# EAGLE design easyMySens-v006 (EAGLE 7.3.0)
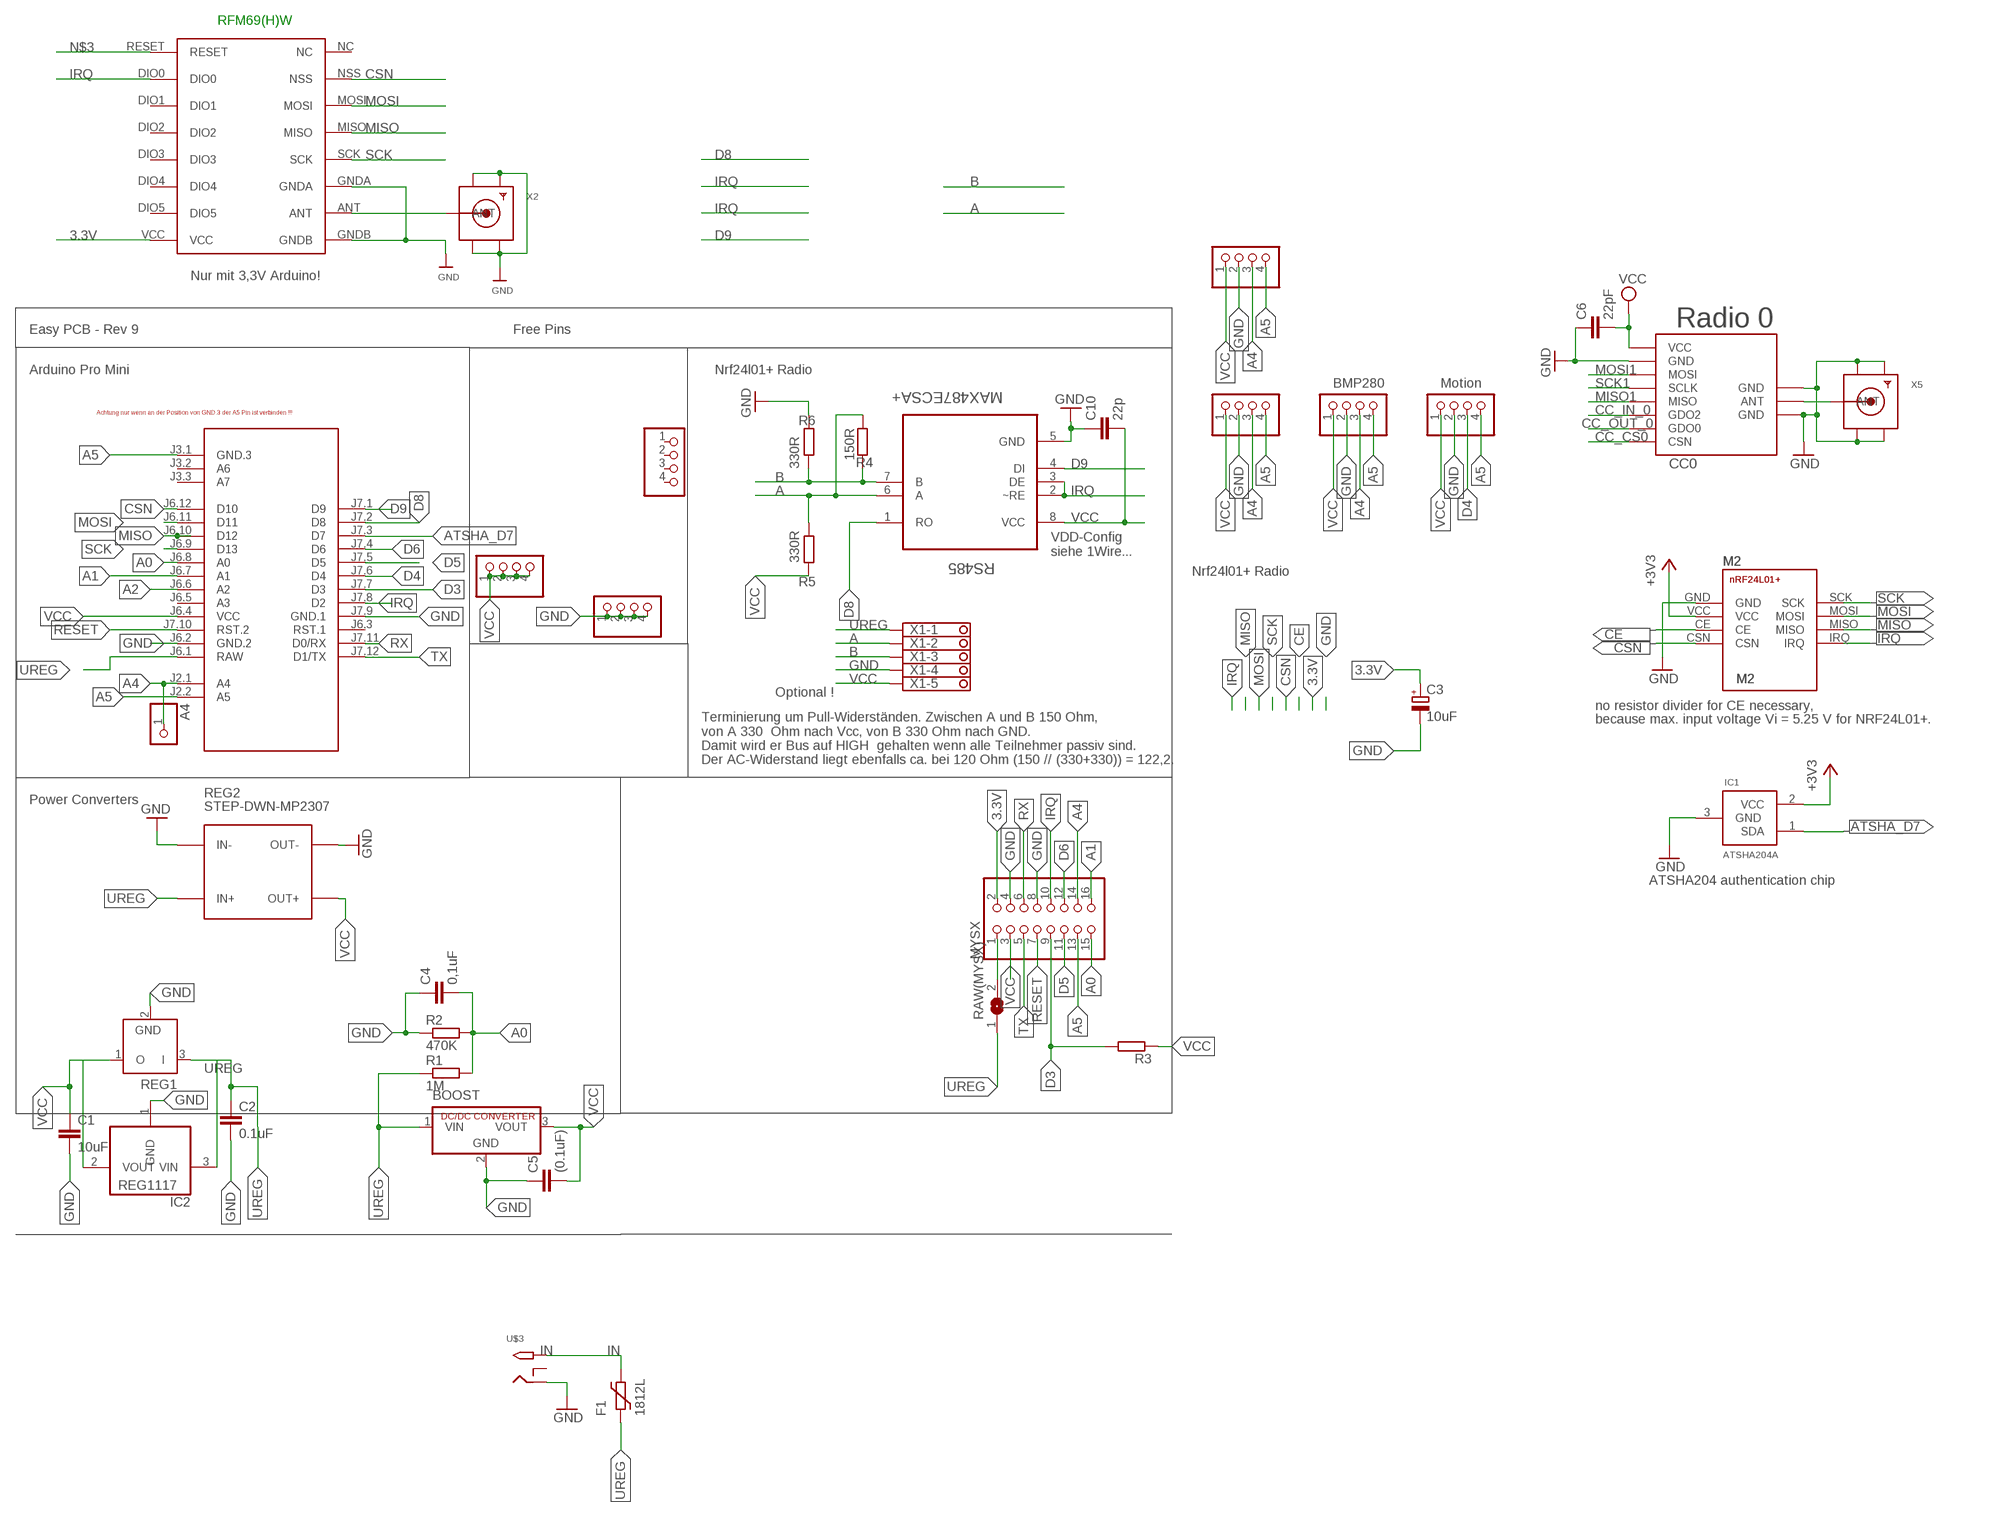
[diagram p0: schematic, sheet 1]

## Parts
A4  PINHD-1X1  [1X01]
BH1750  PINHD-1X04_2.54-S  [1X04-S]
BOOST  R-78C1.8-1.0  [SIP3]
C1  10uF  C-EUC1210  [C1210]
C2  0.1uF  C-EUC1206  [C1206]
C3  10uF  CPOL-EUSMCC  [SMC_C]
C4  0,1uF  C-EUC1206  [C1206]
C5  (0.1uF)  C-EUC1206  [C1206]
C6  22pF  C-EUC0805  [C0805]
C10  22p  C-EUC0805  [C0805]
CC0  CC1101  CC1101_MODULE1SMD  [CC1101_MODULE1_SMD]
F1  1812L  [1812L]
I2C-1  PINHD-1X04_2.54-S  [1X04-S]
I2C-2  PINHD-1X04_2.54-S  [1X04-S]
IC1  ATSHA204A  [SOT23]
IC2  REG1117  [SOT223]
JP1  PINHD-1X04_2.54-S  [1X04-S]
JP3  PINHD-1X04_2.54-S  [1X04-S]
JP12  PINHD-1X04_2.54-S  [1X04-S]
M1  ARDUINO-PRO-MINI-3.3V#NP  [ARDUINO-PRO-MINI#NP]
M2  NRF24L01+SMD  [NRF24L01+SMD]
MOTION  PINHD-1X04_2.54-S  [1X04-S]
MYSX  PINHD-2X08_2.54  [2X08]
R1  1M  R-EU_R0805  [R0805]
R2  470K  R-EU_R0805  [R0805]
R3  R-EU_R0805  [R0805]
R4  150R  R-EU_R0805  [R0805]
R5  330R  R-EU_R0805  [R0805]
R6  330R  R-EU_R0805  [R0805]
RAW(MYSX)  SJ  [SJ]
REG1  LP2950Z  [TO92]
REG2  STEP-DWN-MP2307  DC-DC-STEP-DOWN-MP2307  [DC-DC-STEP-DOWN-MP2307]
RFM69W  RFM69HW  [RFM]
RS485  MAX487ECSA+  [SOIC127P600X175-8N]
U$3  2.1MMJACKTHM  [PJ-102A]
X1  1751277  [1751277]
X2  SMACONNECTOR_EDGE  [SMA_EDGELAUNCH]
X5  SMACONNECTOR_EDGE  [SMA_EDGELAUNCH]

## Nets
3.3V [Power]: C3.+ IC1.2(VCC) M2.VCC MYSX.2 RFM69W.VCC ; supply symbol labelled +3V3
A: R4.1 R5.2 RS485.6(A) X1.2
A0: C4.2 M1.J6.8(A0) MYSX.15 R1.2 R2.2
A1: M1.J6.7(A1) MYSX.16
A2: M1.J6.6(A2)
A4: A4.1 BH1750.3 I2C-1.3 I2C-2.3 M1.J2.1(A4) MYSX.14
A5: BH1750.4 I2C-1.4 I2C-2.4 M1.J2.2(A5) M1.J3.1(GND.3) MOTION.4 MYSX.13
ANT0: CC0.ANT X5.P(ANT)
ATSHA_D7: IC1.1(SDA) M1.J7.3(D7)
B: R4.2 R6.1 RS485.7(B) X1.3
CC_CS0: CC0.CSN
CC_IN_0: CC0.GDO2
CC_OUT_0: CC0.GDO0
CE: M2.CE
CSN: M1.J6.12(D10) M2.CSN RFM69W.NSS
D3: M1.J7.7(D3) MYSX.9 R3.2
D4: M1.J7.6(D4) MOTION.3
D5: M1.J7.5(D5) MYSX.11
D6: M1.J7.4(D6) MYSX.12
D8: M1.J7.2(D8) RS485.1(RO)
D9: M1.J7.1(D9) RS485.4(DI)
GND [Power]: BH1750.2 BOOST.2(GND) C1.2 C2.2 C3.- C4.1 C5.1 C6.1 C10.1 CC0.GND@0(GND) CC0.GND@1(GND) CC0.GND@2(GND) I2C-1.2 I2C-2.2 IC1.3(GND) IC2.1(GND) JP1.1 JP1.2 JP1.3 JP1.4 M1.J6.2(GND.2) M1.J7.9(GND.1) M2.GND MOTION.2 MYSX.4 MYSX.8 R2.1 R6.2 REG1.2(GND) REG2.IN- REG2.OUT- RFM69W.GNDA RFM69W.GNDB RS485.5(GND) U$3.RING X1.4 X2.GND@1(GND4) X2.GND@2(GND3) X2.GND@3(GND2) X2.GND@4(GND1) X5.GND@1(GND4) X5.GND@2(GND3) X5.GND@3(GND2) X5.GND@4(GND1)
IN [Power]: F1.P$2 U$3.TIP
IRQ: M1.J7.8(D2) M2.IRQ MYSX.10 RFM69W.DIO0 RS485.2(~RE) RS485.3(DE)
MISO: M1.J6.10(D12) M2.MISO RFM69W.MISO
MISO1: CC0.MISO
MOSI: M1.J6.11(D11) M2.MOSI RFM69W.MOSI
MOSI1: CC0.MOSI
N$1: MYSX.1 RAW(MYSX).2
N$3: RFM69W.RESET
N$16: RFM69W.ANT X2.P(ANT)
RESET: M1.J7.10(RST.2) MYSX.7
RX: M1.J7.11(D0/RX) MYSX.6
SCK: M1.J6.9(D13) M2.SCK RFM69W.SCK
SCK1: CC0.SCLK
TX: M1.J7.12(D1/TX) MYSX.5
UREG [Power]: BOOST.1(VIN) C2.1 F1.P$1 IC2.3(VIN) M1.J6.1(RAW) R1.1 RAW(MYSX).1 REG1.3(I) REG2.IN+ X1.1
VCC [Power]: BH1750.1 BOOST.3(VOUT) C1.1 C5.2 C6.2 C10.2 CC0.VCC I2C-1.1 I2C-2.1 IC2.2(VOUT) JP3.1 JP3.2 JP3.3 JP3.4 M1.J6.4(VCC) MOTION.1 MYSX.3 R3.1 R5.1 REG1.1(O) REG2.OUT+ RS485.8(VCC) X1.5
Unconnected: JP12.1 JP12.2 JP12.3 JP12.4 M1.J3.2(A6) M1.J3.3(A7) M1.J6.3(RST.1) M1.J6.5(A3) RFM69W.DIO1 RFM69W.DIO2 RFM69W.DIO3 RFM69W.DIO4 RFM69W.DIO5 RFM69W.NC U$3.RING_SW

## Notes on the sheet
- RFM69(H)W
- Nur mit 3,3V Arduino!
- Radio 0
- Easy PCB - Rev 9 | Free Pins
- Arduino Pro Mini | Nrf24l01+ Radio
- BMP280 | Motion
- Achtung nur wenn an der Position von GND.3 der A5 Pin ist verbinden !!!
- VDD-Config
  siehe 1Wire...
- Nrf24l01+ Radio
- Optional !
- no resistor divider for CE necessary,
- because max. input voltage Vi = 5.25 V for NRF24L01+.
- Terminierung um Pull-Widerständen. Zwischen A und B 150 Ohm,
  von A 330  Ohm nach Vcc, von B 330 Ohm nach GND. 
  Damit wird er Bus auf HIGH  gehalten wenn alle Teilnehmer passiv sind.
  Der AC-Widerstand liegt ebenfalls ca. bei 120 Ohm (150 // (330+330)) = 122,2.
- Power Converters
- ATSHA204 authentication chip

## Library data of the parts
A4 = pinhead:PINHD-1X1: PIN HEADER
BH1750 I2C-1 I2C-2 JP1 JP3 JP12 MOTION = pinhead-2:PINHD-1X04: PIN HEADER
BOOST = dc-dc-converter:R-78C*-1.0: INNOLINE DC/DC-Converter 1.0 AMP SIP3 Single Output Source: Data sheet <http://www.mikrocontroller.net/attachment/150645/157764-da-01-en-DC_DC_WANDLER_R_78C5_0_1_0.pdf>
C1 C2 C4-C6 C10 = rcl:C-EU: CAPACITOR, European symbol
C3 = rcl:CPOL-EU: POLARIZED CAPACITOR, European symbol
CC0 = wireless:CC1101_MODULE1: CC1101 wireless module for 433/868 MHz (sold from Aliexpress). DIL version for mounting with pin header (and SMD soldering) and SMD only variant available.
F1 = ptc-littlefuse:1812L
IC1 = Sensor:ATSHA204A
IC2 = burr-brown:REG1117: 800mA and 1A Low Dropout (LDO) Positive Regulator 1.8V, 2.5V, 2.85V, 3.3V, 5V, and Adj; MPN: REG1117; OC_FARNELL: 1097566; OC_NEWARK: 14P6981
M1 = diy-modules:ARDUINO-PRO-MINI-*#NP: Arduino Pro Mini without programming pads
M2 = wireless:NRF24L01+: nRF24L01+ Transceiver Module
MYSX = pinhead-2:PINHD-2X08: PIN HEADER
R1-R6 = rcl:R-EU_: RESISTOR, European symbol
RAW(MYSX) = jumper:SJ: SMD solder JUMPER
REG1 = linear:LP2950: 100 mA, Low Power Low Dropout Voltage Regulator Source: http://www.onsemi.com/pub/Collateral/LP2950-D.PDF
REG2 = diy-modules:DC-DC-STEP-DOWN-MP2307: DC/DC Step-Down Regulator based on MP2307DN chip MP2307 datasheet available here: https://cdn-shop.adafruit.com/datasheets/MP2307_r1.9.pdf Click here to find device on ebay.com <http://www.ebay.com/sch/dc+dc+3a+mini+converter>
RFM69W = hoperf:RFM69HW
RS485 = Maxim_By_element14_Batch_1:MAX487ECSA+: Low-Power, Slew-Rate-Limited RS-485/RS-422 Transceivers; MPN: MAX487ECSA+; OC_FARNELL: 9724532; OC_NEWARK: 68K4803; PACKAGE: SOIC-8; SUPPLIER: Maxim
U$3 = adafruit:2.1MMJACK: 2.1mm x 5.5mm THM DC jack with internal switch. Digikey part #PJ-102A, 4UCON part #05537 2.1mm x 5.5mm SMT DC jack with internal switch. Digikey part #PJ-002A-SMT, 4UCON part #03267 By microbuilder.eu & adafruit.com
X1 = con-phoenix-350:1751277: MKDS 1/ 5-3,5 Printklemme Nennstrom: 10 A Bemessungsspannung: 160 V Raster: 3,5 mm Polzahl: 5 Montageart: Löten Anschlussart: Schraubanschluss Anschlussrichtung vom Leiter zur Platine: 0° Source: http://eshop.phoenixcontact.com .. 1751277.pdf; OC_FARNELL: unknown; OC_NEWARK: unknown
X2 X5 = adafruit:SMACONNECTOR: SMA Connector 90° DIP SMA Connector, 50 Ohm (4UConnector: 07259)

## Net classes
0 default: width 0.305 mm
1 Power: width 0.508 mm

## Board
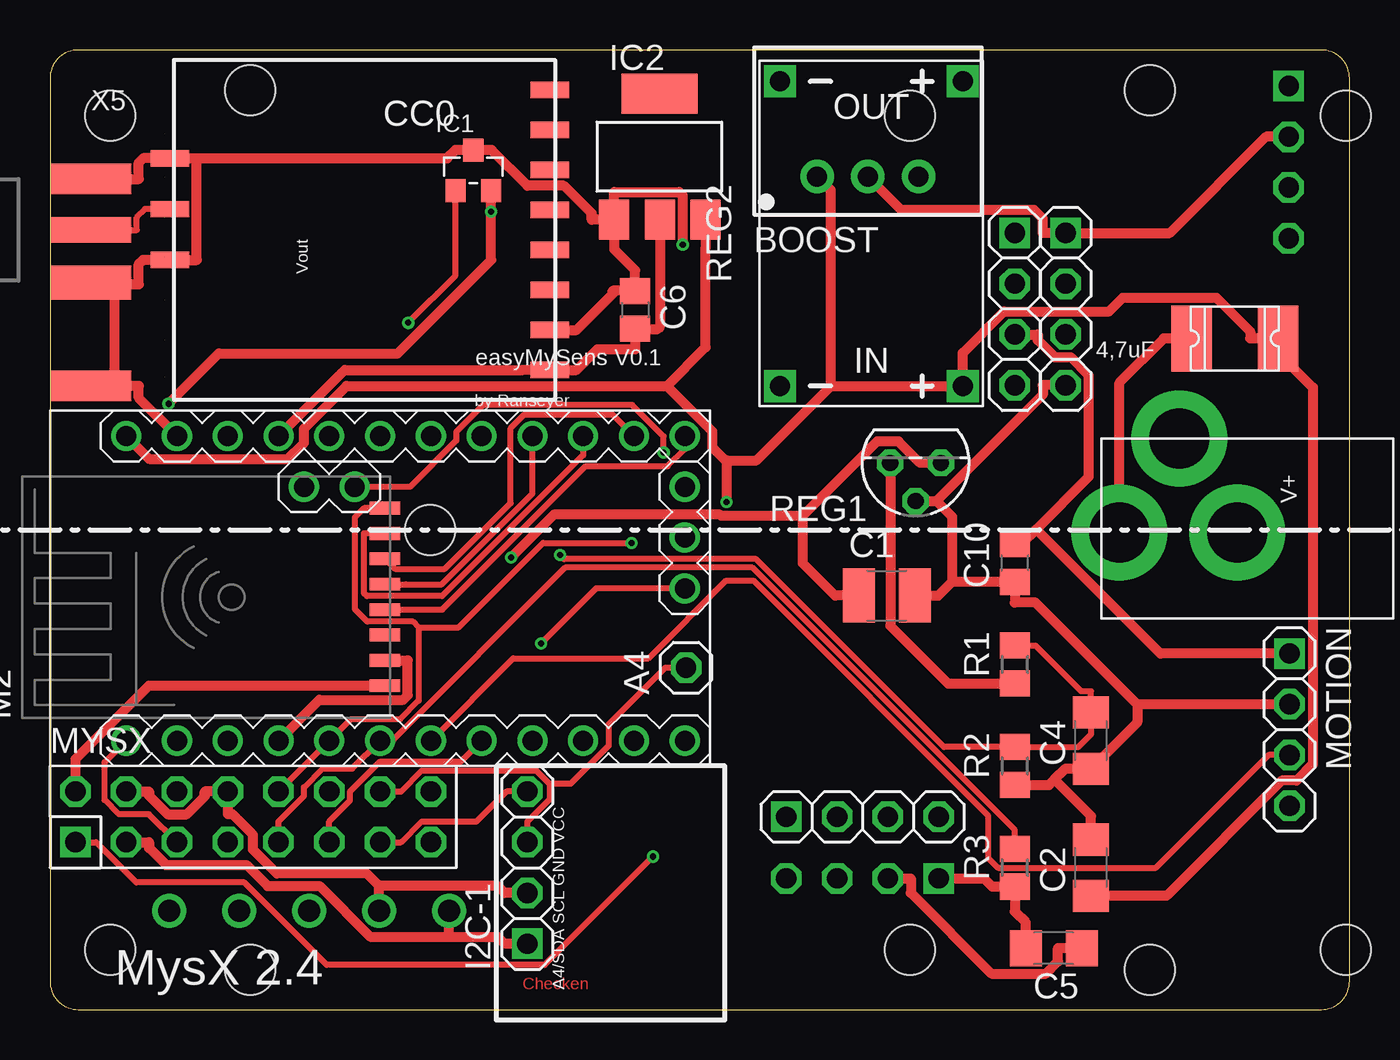
[diagram p1: board, top side]
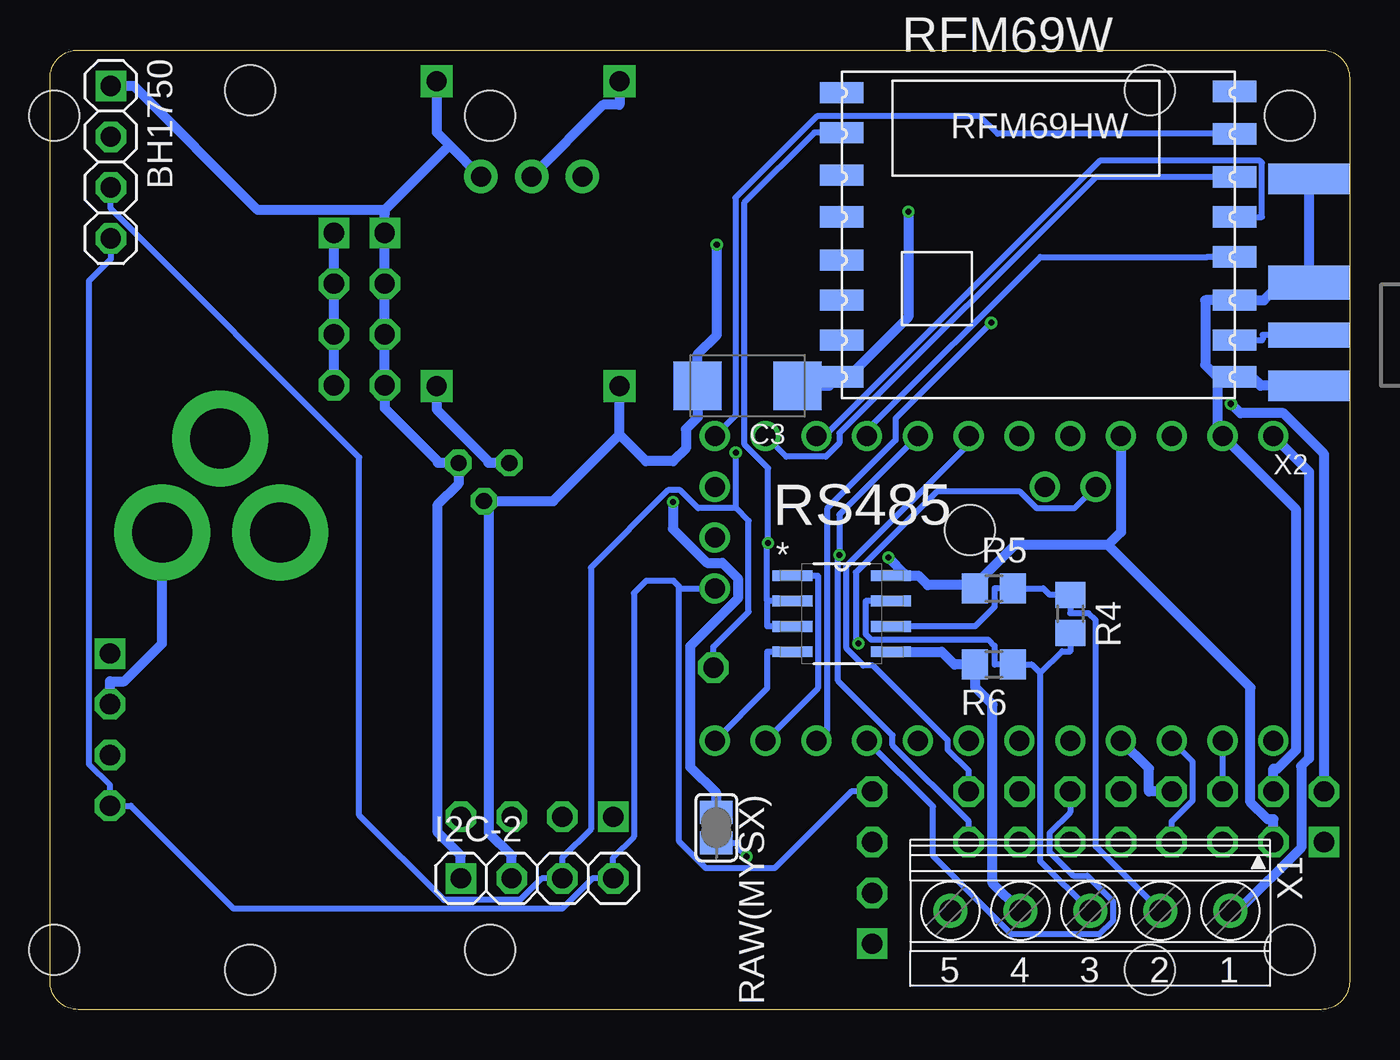
[diagram p2: board, bottom side, seen from below]

Size 65 x 48 mm. Coordinates in mm from the lower left corner, seen from the top.
Outline: 0,46.59 0,1.41 arc90 1.41,0 63.59,0 arc90 65,1.41 65,46.59 arc90 63.59,48 1.41,48 arc90 0,46.59
Copper layers (1*16): Top 0.035mm / dielectric 1.5mm / Bottom 0.035mm
Design rules "dirt_cheap_dirty_boards.v1": minimum track width 5mil, minimum drill 12mil, track to track 5mil, track to pad 5mil, pad to pad 5mil, via to via 5mil, smd to smd 0mil, copper to edge 10mil, drill to drill 10mil, minimum pad ring 10mil, minimum via ring 6mil, stop-mask expansion 2mil, vias tented up to drill 25mil, thermal gap 10mil
Holes 2.5 mm at 19,24 3,3 3,44.7 64.8,44.7 43,3 64.8,3 43,44.7 10,2 55,2 10,46 55,46
tRestrict: 20 lines
bRestrict: 19 lines

### Footprints (pad centres in the part's own frame; a part is rotated, then mirrored left to right if it is on the bottom)
1X01 = drill 1.016 octagon: 1 0,0
1X04-S = drill 1.016 square: 1 -3.81,0 | drill 1.016 octagon: 2 -1.27,0; 3 1.27,0; 4 3.81,0
SIP3 = drill 1 pad 1.676: 1 -2.54,0; 2 0,0; 3 2.54,0
C1210 = smd 1.6 x 2.7: 1 -1.4,0; 2 1.4,0
C1206 = smd 1.6 x 1.8: 1 -1.4,0; 2 1.4,0
SMC_C = smd 2.4 x 2.4: + -2.5,0; - 2.5,0
C0805 = smd 1.3 x 1.5: 1 -0.95,0; 2 0.95,0
CC1101_MODULE1_SMD = smd 1.93 x 0.813: ANT 19,5.96; CSN 0,0; GDO0 0,2; GDO2 0,4; GND@0 0,12; GND@1 19,8.5; GND@2 19,3.42; MISO 0,6; MOSI 0,10; SCLK 0,8; VCC 0,14
1812L = smd 2.03 x 3.3: P$1 -2.16,0; P$2 2.16,0
SOT23 = smd 1.016 x 1.143: 1 -0.889,-1.016; 2 0.889,-1.016; 3 0,1.016
SOT223 = smd 1.499 x 2.007: 1 -2.261,-3.15; 2 0.025,-3.15; 3 2.311,-3.15 | smd 3.81 x 2.007: 4 0,3.15
ARDUINO-PRO-MINI#NP = drill 1: J2.1 -1.27,5.08; J2.2 -3.81,5.08; J3.1 15.24,0; J3.2 15.24,2.54; J3.3 15.24,5.08; J6.1 -12.7,7.62; J6.2 -10.16,7.62; J6.3 -7.62,7.62; J6.4 -5.08,7.62; J6.5 -2.54,7.62; J6.6 0,7.62; J6.7 2.54,7.62; J6.8 5.08,7.62; J6.9 7.62,7.62; J6.10 10.16,7.62; J6.11 12.7,7.62; J6.12 15.24,7.62; J7.1 15.24,-7.62; J7.2 12.7,-7.62; J7.3 10.16,-7.62; J7.4 7.62,-7.62; J7.5 5.08,-7.62; J7.6 2.54,-7.62; J7.7 0,-7.62; J7.8 -2.54,-7.62; J7.9 -5.08,-7.62; J7.10 -7.62,-7.62; J7.11 -10.16,-7.62; J7.12 -12.7,-7.62
NRF24L01+SMD = smd 0.635 x 1.524: CE -1.575,-7.861; CSN -0.305,-7.861; GND -2.845,-7.861; IRQ 4.775,-7.861; MISO 3.505,-7.861; MOSI 2.235,-7.861; SCK 0.965,-7.861; VCC -4.115,-7.861
2X08 = drill 1.016 square: 1 -8.89,-1.27 | drill 1.016 octagon: 2 -8.89,1.27; 3 -6.35,-1.27; 4 -6.35,1.27; 5 -3.81,-1.27; 6 -3.81,1.27; 7 -1.27,-1.27; 8 -1.27,1.27; 9 1.27,-1.27; 10 1.27,1.27; 11 3.81,-1.27; 12 3.81,1.27; 13 6.35,-1.27; 14 6.35,1.27; 15 8.89,-1.27; 16 8.89,1.27
R0805 = smd 1.3 x 1.5: 1 -0.95,0; 2 0.95,0
SJ = smd 1.168 x 1.6: 1 -0.762,0; 2 0.762,0
TO92 = drill 0.813 octagon: 1 -1.27,0; 2 0,1.905; 3 1.27,0
DC-DC-STEP-DOWN-MP2307 = drill 1 pad 1.6 square: IN+ -7.62,-4.572; IN- -7.62,4.572; OUT+ 7.62,-4.572; OUT- 7.62,4.572
RFM = smd 2.184 x 1.067: ANT 19.651,2.889; DIO0 0,13.27; DIO1 0,11.143; DIO2 0,9.047; DIO3 0,6.889; DIO4 0,4.889; DIO5 0,2.889; GNDA 19.651,4.889; GNDB 19.651,1.048; MISO 19.651,9.047; MOSI 19.651,11.047; NC 19.651,15.334; NSS 19.651,13.206; RESET 0,15.27; SCK 19.651,7.048; VCC 0,1.048
SOIC127P600X175-8N = smd 1.981 x 0.533: 1 -2.464,1.905; 2 -2.464,0.635; 3 -2.464,-0.635; 4 -2.464,-1.905; 5 2.464,-1.905; 6 2.464,-0.635; 7 2.464,0.635; 8 2.464,1.905
PJ-102A = drill 3 pad 4.8: RING 0.1,-3.39; RING_SW -4.6,-6.29; TIP 0.1,-9.29
1751277 = drill 1.1 pad 1.7: 1 -7,-0.1; 2 -3.5,-0.1; 3 0,-0.1; 4 3.5,-0.1; 5 7,-0.1
SMA_EDGELAUNCH = smd 4.064 x 1.524: GND@1 2.032,-2.54; GND@2 2.032,2.54 | smd 4.064 x 1.524 bottom: GND@3 2.032,2.54; GND@4 2.032,-2.54 | smd 4.064 x 1.27: P 2.032,0

### Placement (x,y rotation side)
A4  31.82,17.1 90 top
BH1750  61.96,42.39 270 bottom
BOOST  40.91,41.67 0 top
C1  41.85,20.7 0 top
C2  52.07,7.1 90 top
C3  30.11,31.2 180 bottom
C4  52.07,13.45 90 top
C5  50.2,3.07 180 top
C6  29.27,35 270 top
C10  48.26,22.34 90 top
CC0  25,46 180 top
F1  59.27,33.57 180 top
I2C-1  23.88,7.1 90 top
I2C-2  40.64,6.56 0 bottom
IC1  21.18,41.97 0 top
IC2  30.48,42.66 0 top
JP1  50.8,35.04 270 top
JP3  48.26,35.04 270 top
JP12  40.64,9.64 0 top
M1  16.51,21.07 0 top
M2  8.89,20.31 90 top
MOTION  62,14 270 top
MYSX  10.16,9.64 0 top
R1  48.26,17.26 90 top
R2  48.26,12.18 90 top
R3  48.26,7.1 90 top
R4  13.97,19.8 270 bottom
R5  17.78,21.07 0 bottom
R6  17.78,17.26 180 bottom
RAW(MYSX)  31.68,9.1 270 bottom
REG1  43.3,27.34 180 top
REG2  41.09,38.81 90 top
RFM69W  25.4,30.59 0 bottom
RS485  25.4,19.8 0 bottom
U$3  62.78,23.96 270 top
X1  12.97,4.83 180 bottom
X2  0,33.74 180 bottom
X5  0,39 0 top

### Tracks (layer width: path | path; a pad name or v marks a point on that pad's centre or on a via)
3.3V  (via drill 0.3 pad 0.61)
  Top 0.508: v5.93,30.3 8.45,32.82 17.39,32.82 22.06,37.5 v22.06,39.91 IC1.2 | MYSX.2 1.27,12.52 4.95,16.19 15.61,16.19 M2.VCC
  Bottom 0.508: C3.+ 26.03,31.2 25.58,31.64 RFM69W.VCC 25.07,31.64 22.06,34.64 v22.06,39.91 | MYSX.2 1.27,27.78 3.31,29.83 5.45,29.83 v5.93,30.3
A
  Bottom 0.305: RS485.6 18.73,19.16 17.76,20.14 17.76,21.07 R5.2 15.32,21.07 15,20.75 R4.1 13.97,19.82 13.04,19.82 12.7,19.48 12.7,8.16 X1.2
A0  (via drill 0.3 pad 0.61)
  Top 0.305: v25.52,22.74 25.72,22.54 35.31,22.54 44.72,13.13 R2.2 51.43,13.13 52.07,13.77 C4.2 52.07,15.93 51.57,15.93 49.29,18.21 R1.2
  Bottom 0.305: M1.J6.8 25.52,24.76 v25.52,22.74 25.59,22.67 25.59,16.44 22.86,13.72 22.86,13.22 19.05,9.41 MYSX.15
A1
  Bottom 0.305: MYSX.16 19.05,11.95 20.09,12.99 20.09,13.47 23.83,17.21 24.32,17.21 25.15,18.05 25.15,22.18 19.05,28.28 M1.J6.7
A4  (via drill 0.3 pad 0.61)
  Top 0.305: A4.1 30.77,17.1 27.94,14.27 27.94,13.19 26.04,11.3 24.98,11.3 | 24.98,11.3 24.98,10.52 23.88,9.41 I2C-1.3 | 24.98,11.3 24.32,11.95 18.59,11.95 17.55,10.91 MYSX.14 | v30.7,27.86 30.7,28.67 29.12,30.24 21.67,30.24 20.32,28.89 20.32,28.46 18.01,26.15 M1.J2.1
  Bottom 0.305: 30.7,25.08 32.58,25.08 33.48,25.98 34.08,25.98 37.95,22.11 37.95,9.02 39.37,7.6 I2C-2.3 40.41,6.56 41.49,5.48 45.3,5.48 49.52,9.71 49.52,27.62 61.96,40.05 BH1750.3 | 30.7,25.08 30.06,24.44 30.06,19.9 31.82,18.14 A4.1 | 30.7,25.08 v30.7,27.86
A5  (via drill 0.3 pad 0.61)
  Top 0.305: M1.J3.1 27.32,21.07 v24.56,18.31 | I2C-1.4 22.83,10.91 21.34,9.41 18.59,9.41 17.55,8.37 MYSX.13
  Bottom 0.305: M1.J2.2 13.79,25.06 15.63,25.06 16.48,25.91 20.65,25.91 24.69,21.87 24.69,18.44 v24.56,18.31 | 33.53,21.07 33.53,21.16 33.81,21.44 35.18,21.44 35.79,20.83 35.79,8.64 36.83,7.6 I2C-2.4 37.24,6.56 37.87,6.56 39.38,5.05 55.82,5.05 60.96,10.19 MOTION.4 62,11.23 63.04,12.27 63.04,36.45 61.96,37.54 BH1750.4 | 33.53,21.07 33.53,8.41 32.19,7.07 28.76,7.07 24.92,10.91 I2C-1.4 | 33.53,21.07 M1.J3.1
ANT0
  Top 0.305: X5.P 4.34,39 4.34,39.63 4.75,40.04 CC0.ANT
ATSHA_D7  (via drill 0.3 pad 0.61)
  Top 0.305: v17.92,34.35 20.29,36.72 IC1.1
  Bottom 0.305: v17.92,34.35 22.71,29.57 22.71,28.48 26.13,25.05 26.13,13.99 M1.J7.3
B
  Bottom 0.305: X1.3 15.46,7.42 15.46,16.83 | RS485.7 24.21,20.44 24.21,18.78 23.93,18.5 18.07,18.5 17.76,18.19 17.76,17.26 R6.1 15.9,17.26 15.89,17.26 15.46,16.83 | 15.46,16.83 14.37,17.92 13.97,17.92 R4.2
CSN  (1 unrouted)
  Top 0.305: M2.CSN 19.62,20 26.8,27.18 30.89,27.18 31.75,28.04 M1.J6.12
  Bottom 0.305: RFM69W.NSS 17.6,43.8 18.48,44.68 26.64,44.68 30.72,40.6 30.72,29.72 M1.J6.12
D3
  Top 0.305: 48.26,8.98 | 48.26,8.98 35.14,22.1 25.77,22.1 17.11,13.45 M1.J7.7 15.12,12.06 13.64,12.06 12.7,11.12 12.7,10.68 11.43,9.41 MYSX.9 | R3.2 48.26,8.98
D4
  Top 0.305: M1.J7.6 23.17,17.57 29.93,17.57 33.82,21.45 35.18,21.45 46.92,9.7 46.92,7.58 47.41,7.09 55.32,7.09 60.96,12.73 MOTION.3
D5
  Top 0.305: MYSX.11 13.97,9.41 15.01,10.45 15.01,10.91 16.51,12.41 20.55,12.41 M1.J7.5
D6
  Bottom 0.305: MYSX.12 13.97,9.87 15.01,8.83 15.01,7.89 13.81,6.69 13.12,6.69 11.84,5.4 11.84,4.45 12.53,3.75 16.91,3.75 20.83,7.68 20.83,10.15 M1.J7.4
D8
  Bottom 0.305: RS485.1 26.59,21.7 26.59,16.07 M1.J7.2
D9
  Bottom 0.305: M1.J7.1 29.13,16.07 29.13,17.9 RS485.4
GND  (via drill 0.3 pad 0.61)  (2 unrouted)
  Top 0.508: BOOST.2 42.59,39.99 49.23,39.99 49.66,39.56 49.66,38.85 JP1.1 56.01,38.85 60.82,43.66 BH1750.2 | C5.1 50.42,3.07 50.42,2.41 49.8,1.79 47.1,1.79 43.05,5.83 43.05,6.56 I2C-2.2 | MYSX.4 4.95,10.91 4.95,10.69 5.88,9.77 6.84,9.77 7.75,10.67 7.75,10.91 MYSX.8 8.89,9.77 9.13,9.77 10.16,8.73 10.16,7.99 11.34,6.81 15.84,6.81 16.47,6.18 | 16.47,6.18 22.39,6.18 22.73,5.83 I2C-1.2 | X1.4 16.47,6.18 | M2.GND 17.89,17.46 17.89,15.72 17.67,15.49 13.47,15.49 M1.J7.9 | 7.35,42.58 19.88,42.58 20.29,42.99 IC1.3 22.1,42.99 23.88,41.21 25.7,41.21 27.09,39.83 27.09,39.51 IC2.1 | 7.35,42.58 7.35,37.5 CC0.GND@1 4.65,37.5 4.45,37.29 4.45,36.28 3.24,36.28 | IC2.1 28.22,40.89 31.48,40.89 31.65,40.73 v31.65,38.26 | 3.24,31.2 4.45,31.2 4.45,30.59 M1.J6.2 | X2.GND@3 3.24,31.2 | 3.24,36.28 X2.GND@1 X5.GND@4 | 3.24,31.2 3.24,36.28 | 7.35,42.58 CC0.GND@2 4.65,42.58 4.45,42.37 4.45,41.54 X5.GND@3 | 50.24,11.51 50.79,12.05 C4.1 54.38,14.36 54.38,15.27 | R2.1 49.97,11.23 50.24,11.51 | 50.24,11.51 52.07,9.68 C2.2 | 54.38,15.27 49.29,20.36 48.26,20.36 C10.1 47.29,21.39 45.12,21.39 | 54.38,15.27 61.02,15.27 MOTION.2 | 45.12,21.39 44.43,20.7 C1.2 | 44.34,25.44 45.12,24.66 45.12,21.39 | CC0.GND@0 26.35,34 28.14,35.79 28.14,35.95 C6.1 29.27,36.98 28.22,38.03 IC2.1 | JP1.4 49.66,31.23 49.66,30.76 44.34,25.44 | REG1.2 44.34,25.44
  Bottom 0.508: X1.4 17.86,6.32 17.86,15.26 18.73,16.13 R6.2 19.76,17.26 20.4,17.9 RS485.5 | 36.51,28.76 REG2.IN- | 36.51,28.76 35.19,27.44 33.83,27.44 33.19,28.07 33.19,29.04 32.61,29.62 C3.- 32.61,32.78 31.65,33.74 v31.65,38.26 | 43.05,25.44 39.83,25.44 36.51,28.76 | 6.62,31.64 RFM69W.GNDB 4.89,31.64 4.45,31.2 X2.GND@3 | 6.62,31.64 7.22,32.25 7.22,35.48 RFM69W.GNDA 4.28,35.48 3.48,36.28 X2.GND@1 X5.GND@4 X5.GND@3 | 6.62,31.64 6.62,28.96 M1.J6.2 2.67,25.01 2.67,12.98 3.6,12.05 3.81,12.05 MYSX.4 | REG2.OUT- 36.51,45.25 37.33,45.25 BOOST.2 | MOTION.2 62,16.41 61.29,16.41 59.4,18.3 U$3.RING | JP1.4 JP1.3 JP1.2 JP1.1 | I2C-2.2 41.91,7.7 43.05,8.85 43.05,25.44 | REG1.2 43.05,25.44 | MYSX.8 10.03,10.91 10.03,12.05 M1.J7.9
IN
  Top 0.508: F1.P$2 55.71,33.57 53.49,31.36 U$3.TIP
IRQ  (via drill 0.3 pad 0.61)
  Top 0.305: 18.45,19.11 20.44,19.11 24.67,23.34 v29.08,23.34 | 18.45,19.11 18.15,19.41 15.87,19.41 15.26,20.01 15.26,24.63 15.71,25.08 M2.IRQ | 18.45,19.11 18.45,15.46 17.51,14.52 15.04,14.52 M1.J7.8 MYSX.10
  Bottom 0.305: 29.13,20.44 29.13,23.29 v29.08,23.34 29.08,27.08 30.26,28.26 30.26,40.38 26.77,43.86 RFM69W.DIO0 | 29.13,20.44 29.03,20.44 RS485.2 | 29.13,20.44 29.13,19.16 RS485.3
MISO  (1 unrouted)
  Top 0.305: M2.MISO 15.71,23.81 15.71,20.82 15.85,20.68 19.61,20.68 26.67,27.74 M1.J6.10
  Bottom 0.305: RFM69W.MISO 4.38,39.64 4.38,42.36 4.48,42.46 12.49,42.46 26.26,28.69 M1.J6.10
MOSI  (1 unrouted)
  Top 0.305: M2.MOSI 17.26,22.04 19.75,22.04 23.04,25.33 23.04,29.08 23.71,29.76 28.14,29.76 M1.J6.11
  Bottom 0.305: RFM69W.MOSI 12.7,41.64 25.51,28.83 25.51,28.34 26.2,27.65 28.17,27.65 M1.J6.11
N$1  (via drill 0.3 pad 0.61)
  Top 0.305: v30.17,7.65 24.75,2.23 13.85,2.23 9.72,6.36 4.32,6.36 2.31,8.37 MYSX.1
  Bottom 0.305: v30.17,7.65 30.59,8.08 30.59,8.34 RAW(MYSX).2
N$16  (1 unrouted)
  Bottom 0.305: X2.P 4.34,33.74 4.34,33.52 4.38,33.48 RFM69W.ANT
RESET
  Bottom 0.305: MYSX.7 8.89,9.41 7.85,10.45 7.85,12.41 M1.J7.10
RX
  Bottom 0.305: MYSX.6 M1.J7.11
SCK  (1 unrouted)
  Top 0.305: M1.J6.9 24.13,25.81 19.59,21.27 17.79,21.27 M2.SCK
  Bottom 0.305: M1.J6.9 24.13,28.98 15.47,37.64 7.12,37.64 RFM69W.SCK
TX
  Top 0.305: MYSX.5 4.95,9.77 3.44,9.77 2.73,10.48 2.73,12.37 M1.J7.12
UREG  (via drill 0.3 pad 0.61)
  Top 0.508: 39.05,31.2 REG2.IN+ 45.66,32.85 47.72,34.91 52.97,34.91 53.66,35.6 58.35,35.6 60.03,33.92 60.03,33.57 60.73,33.57 | 33.84,27.47 35.33,27.47 39.05,31.2 | 39.05,31.2 39.05,40.99 BOOST.1 | 33.84,27.47 v33.84,25.39 | 30.86,31.2 33.12,28.94 33.12,28.13 33.78,27.47 33.84,27.47 | 60.73,33.57 63.17,31.12 63.17,12.28 62.35,11.46 61.62,11.46 55.86,5.7 C2.1 | F1.P$1 60.73,33.57 | M1.J6.1 4.96,27.54 11.9,27.54 12.7,28.35 12.7,29.06 14.84,31.2 30.86,31.2 | 30.86,31.2 32.79,33.13 32.79,38.13 IC2.3 | REG1.3 42.02,19.2 44.91,16.31 R1.1
  Bottom 0.508: REG1.3 43.07,27.34 43.07,27.42 45.66,30.01 REG2.IN+ | RAW(MYSX).1 31.68,10.83 32.98,12.13 32.98,18.17 30.59,20.56 30.59,21.56 31.37,22.34 32.13,22.34 33.84,24.05 v33.84,25.39 | M1.J6.1 2.03,26.91 2.03,12.56 2.41,12.18 2.41,8.1 5.58,4.93 X1.1
VCC  (via drill 0.3 pad 0.61)
  Top 0.508: 37.64,24.69 33.57,24.69 33.51,24.75 25.2,24.75 v23.06,22.61 | 49.33,24.02 48.6,23.29 C10.2 | 49.33,24.02 51.95,26.64 51.95,31.73 51.05,32.63 50.26,32.63 49.4,33.48 49.4,33.77 JP3.3 | MOTION.1 55.54,17.81 49.33,24.02 | 37.64,24.69 37.64,22.33 39.27,20.7 C1.1 | 37.64,24.69 41.37,28.42 42.44,28.42 43.52,27.34 REG1.1 | 19.97,3.64 22.38,3.64 22.73,3.29 I2C-1.1 | 19.97,3.64 16.02,3.64 13.48,6.17 10.88,6.17 9.83,7.23 5.81,7.23 4.95,8.08 4.95,8.37 MYSX.3 | 19.97,3.64 X1.5 | M1.J6.4 14.74,32 23.65,32 CC0.VCC 26.35,32 27.36,33.02 29.27,33.02 C6.2 30.4,34.05 30.5,34.15 IC2.2 | I2C-2.1 46.72,6.56 47.13,6.15 R3.1 48.26,4.89 48.8,4.35 C5.2
  Bottom 0.508: v23.06,22.61 22.25,21.8 22.25,21.7 | 45.01,43.24 BOOST.3 | 45.01,43.24 45.66,43.88 45.66,45.25 REG2.OUT+ | 48.26,39.99 45.01,43.24 | BH1750.1 60.82,46.2 54.61,39.99 48.26,39.99 | 48.26,39.99 48.26,39.83 JP3.1 JP3.2 JP3.3 JP3.4 48.26,30.09 45.61,27.43 45.61,27.34 REG1.1 44.56,26.3 45.61,25.26 45.61,8.86 44.45,7.7 I2C-2.1 | 12.08,23.23 16.74,23.23 18.73,21.24 | M1.J6.4 11.43,23.88 12.08,23.23 | 12.08,23.23 4.95,16.1 4.95,10.37 4.1,9.51 3.81,9.51 MYSX.3 | 22.25,21.7 21.56,21.7 21.09,21.24 18.73,21.24 | RS485.8 22.25,21.7 | 18.73,21.24 R5.1

### Text on the board
Top: Checken
tPlace: Vout | easyMySens V0.1 | by Ranseyer | Gnd | MysX 2.4
tOrigins: G3 | G1 | G1 | G3 | G2 | G3 | G1 | G1 | G3 | Gehäuse 1: Box2252 / Geh2: 59x65 / Gehäuse 3: 67x98
tNames: VCC GND RAW | 4,7uF | I2C | V+ | A4/SDA SCL GND VCC | A5/SCL SDA GND VCC